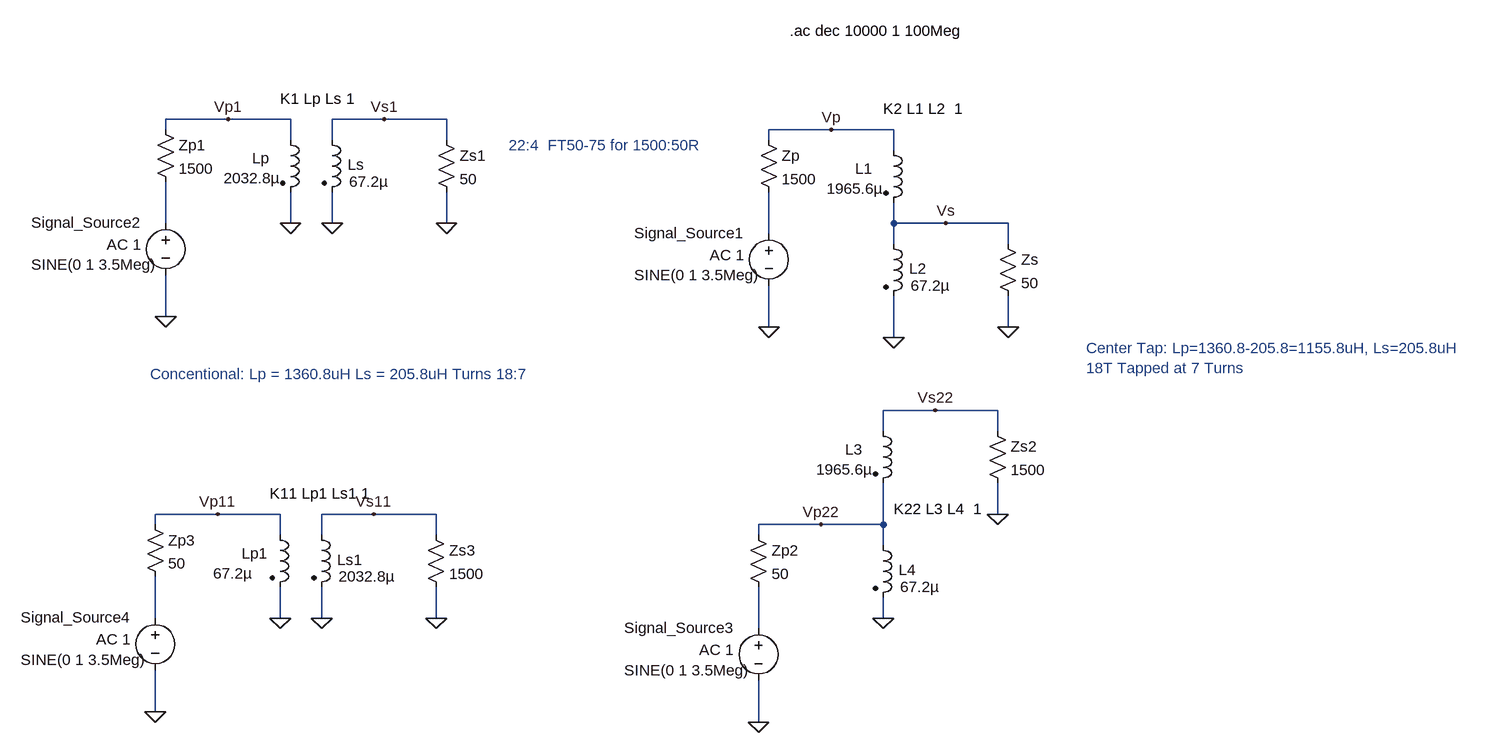
[diagram p0: schematic 1500 to 50 Transformer.asc]
1500 to 50 Transformer.asc, the LTspice schematic file:
Version 4
SHEET 1 880 680
WIRE -1392 -320 -1488 -320
WIRE -1296 -320 -1392 -320
WIRE -1152 -320 -1232 -320
WIRE -1056 -320 -1152 -320
WIRE -1488 -304 -1488 -320
WIRE -464 -304 -560 -304
WIRE -368 -304 -464 -304
WIRE -1296 -288 -1296 -320
WIRE -1232 -288 -1232 -320
WIRE -1056 -288 -1056 -320
WIRE -560 -288 -560 -304
WIRE -368 -272 -368 -304
WIRE -1488 -160 -1488 -224
WIRE -1296 -160 -1296 -208
WIRE -1232 -160 -1232 -208
WIRE -1056 -160 -1056 -208
WIRE -368 -160 -368 -192
WIRE -288 -160 -368 -160
WIRE -192 -160 -288 -160
WIRE -560 -144 -560 -208
WIRE -368 -128 -368 -160
WIRE -192 -128 -192 -160
WIRE -1488 -16 -1488 -80
WIRE -560 0 -560 -64
WIRE -192 0 -192 -48
WIRE -368 16 -368 -48
WIRE -304 128 -384 128
WIRE -208 128 -304 128
WIRE -384 160 -384 128
WIRE -208 160 -208 128
WIRE -1408 288 -1504 288
WIRE -1312 288 -1408 288
WIRE -1168 288 -1248 288
WIRE -1072 288 -1168 288
WIRE -208 288 -208 240
WIRE -1504 304 -1504 288
WIRE -480 304 -576 304
WIRE -384 304 -384 240
WIRE -384 304 -480 304
WIRE -1312 320 -1312 288
WIRE -1248 320 -1248 288
WIRE -1072 320 -1072 288
WIRE -576 320 -576 304
WIRE -384 336 -384 304
WIRE -1504 448 -1504 384
WIRE -1312 448 -1312 400
WIRE -1248 448 -1248 400
WIRE -1072 448 -1072 400
WIRE -384 448 -384 416
WIRE -576 464 -576 400
WIRE -1504 592 -1504 528
WIRE -576 608 -576 544
FLAG -560 0 0
FLAG -464 -304 Vp
FLAG -288 -160 Vs
FLAG -192 0 0
FLAG -368 16 0
FLAG -1488 -16 0
FLAG -1392 -320 Vp1
FLAG -1152 -320 Vs1
FLAG -1056 -160 0
FLAG -1232 -160 0
FLAG -1296 -160 0
FLAG -576 608 0
FLAG -480 304 Vp22
FLAG -304 128 Vs22
FLAG -208 288 0
FLAG -1504 592 0
FLAG -1408 288 Vp11
FLAG -1168 288 Vs11
FLAG -1072 448 0
FLAG -1248 448 0
FLAG -1312 448 0
FLAG -384 448 0
SYMBOL voltage -560 -160 R0
WINDOW 3 -207 80 Left 2
WINDOW 123 -91 49 Left 2
WINDOW 39 0 0 Left 2
WINDOW 0 -207 15 Left 2
SYMATTR Value SINE(0 1 3.5Meg)
SYMATTR Value2 AC 1
SYMATTR InstName Signal_Source1
SYMBOL res -208 -144 R0
SYMATTR InstName Zs
SYMATTR Value 50
SYMBOL ind2 -384 -288 R0
WINDOW 0 -43 44 Left 2
WINDOW 3 -87 75 Left 2
SYMATTR InstName L1
SYMATTR Value 1965.6µ
SYMATTR Type ind
SYMBOL ind2 -384 -144 R0
WINDOW 0 40 54 Left 2
WINDOW 3 42 80 Left 2
SYMATTR InstName L2
SYMATTR Value 67.2µ
SYMATTR Type ind
SYMBOL res -576 -304 R0
SYMATTR InstName Zp
SYMATTR Value 1500
SYMBOL voltage -1488 -176 R0
WINDOW 3 -207 80 Left 2
WINDOW 123 -91 49 Left 2
WINDOW 39 0 0 Left 2
WINDOW 0 -207 15 Left 2
SYMATTR Value SINE(0 1 3.5Meg)
SYMATTR Value2 AC 1
SYMATTR InstName Signal_Source2
SYMBOL res -1072 -304 R0
SYMATTR InstName Zs1
SYMATTR Value 50
SYMBOL ind2 -1312 -304 R0
WINDOW 0 -43 44 Left 2
WINDOW 3 -87 75 Left 2
SYMATTR InstName Lp
SYMATTR Value 2032.8µ
SYMATTR Type ind
SYMBOL ind2 -1248 -304 R0
WINDOW 0 40 54 Left 2
WINDOW 3 42 80 Left 2
SYMATTR InstName Ls
SYMATTR Value 67.2µ
SYMATTR Type ind
SYMBOL res -1504 -320 R0
SYMATTR InstName Zp1
SYMATTR Value 1500
SYMBOL voltage -576 448 R0
WINDOW 3 -207 80 Left 2
WINDOW 123 -91 49 Left 2
WINDOW 39 0 0 Left 2
WINDOW 0 -207 15 Left 2
SYMATTR Value SINE(0 1 3.5Meg)
SYMATTR Value2 AC 1
SYMATTR InstName Signal_Source3
SYMBOL res -224 144 R0
SYMATTR InstName Zs2
SYMATTR Value 1500
SYMBOL ind2 -400 144 R0
WINDOW 0 -43 44 Left 2
WINDOW 3 -87 75 Left 2
SYMATTR InstName L3
SYMATTR Value 1965.6µ
SYMATTR Type ind
SYMBOL ind2 -400 320 R0
WINDOW 0 40 54 Left 2
WINDOW 3 42 80 Left 2
SYMATTR InstName L4
SYMATTR Value 67.2µ
SYMATTR Type ind
SYMBOL res -592 304 R0
SYMATTR InstName Zp2
SYMATTR Value 50
SYMBOL voltage -1504 432 R0
WINDOW 3 -207 80 Left 2
WINDOW 123 -91 49 Left 2
WINDOW 39 0 0 Left 2
WINDOW 0 -207 15 Left 2
SYMATTR Value SINE(0 1 3.5Meg)
SYMATTR Value2 AC 1
SYMATTR InstName Signal_Source4
SYMBOL res -1088 304 R0
SYMATTR InstName Zs3
SYMATTR Value 1500
SYMBOL ind2 -1328 304 R0
WINDOW 0 -43 44 Left 2
WINDOW 3 -87 75 Left 2
SYMATTR InstName Lp1
SYMATTR Value 67.2µ
SYMATTR Type ind
SYMBOL ind2 -1264 304 R0
WINDOW 0 40 54 Left 2
WINDOW 3 42 80 Left 2
SYMATTR InstName Ls1
SYMATTR Value 2032.8µ
SYMATTR Type ind
SYMBOL res -1520 288 R0
SYMATTR InstName Zp3
SYMATTR Value 50
TEXT -528 -456 Left 2 !.ac dec 10000 1 100Meg
TEXT -384 -336 Left 2 !K2 L1 L2  1
TEXT -960 -280 Left 2 ;22:4  FT50-75 for 1500:50R
TEXT -72 32 Left 2 ;Center Tap: Lp=1360.8-205.8=1155.8uH, Ls=205.8uH\n18T Tapped at 7 Turns
TEXT -1312 -352 Left 2 !K1 Lp Ls 1
TEXT -368 280 Left 2 !K22 L3 L4  1
TEXT -1328 256 Left 2 !K11 Lp1 Ls1 1
TEXT -1512 72 Left 2 ;Concentional: Lp = 1360.8uH Ls = 205.8uH Turns 18:7

The netlist it stands for:
* 1500 to 50 Transformer.asc
V§Signal_Source1 N002 0 SINE(0 1 3.5Meg) AC 1
R§Zs Vs 0 50
L1 Vp Vs 1965.6µ
L2 Vs 0 67.2µ
R§Zp Vp N002 1500
V§Signal_Source2 N001 0 SINE(0 1 3.5Meg) AC 1
R§Zs1 Vs1 0 50
Lp Vp1 0 2032.8µ
Ls Vs1 0 67.2µ
R§Zp1 Vp1 N001 1500
V§Signal_Source3 N004 0 SINE(0 1 3.5Meg) AC 1
R§Zs2 Vs22 0 1500
L3 Vs22 Vp22 1965.6µ
L4 Vp22 0 67.2µ
R§Zp2 Vp22 N004 50
V§Signal_Source4 N003 0 SINE(0 1 3.5Meg) AC 1
R§Zs3 Vs11 0 1500
Lp1 Vp11 0 67.2µ
Ls1 Vs11 0 2032.8µ
R§Zp3 Vp11 N003 50
.ac dec 10000 1 100Meg
K2 L1 L2  1
* 22:4  FT50-75 for 1500:50R
* Center Tap: Lp=1360.8-205.8=1155.8uH, Ls=205.8uH
* 18T Tapped at 7 Turns
K1 Lp Ls 1
K22 L3 L4  1
K11 Lp1 Ls1 1
* Concentional: Lp = 1360.8uH Ls = 205.8uH Turns 18:7
.backanno
.end